# Altium schematic sheet MB979.SchDoc: LCD glass module
size A4; DocumentNumber: 2; Revision: A.1[PCB.SCH]; SheetNumber: 2; SheetTotal: 2
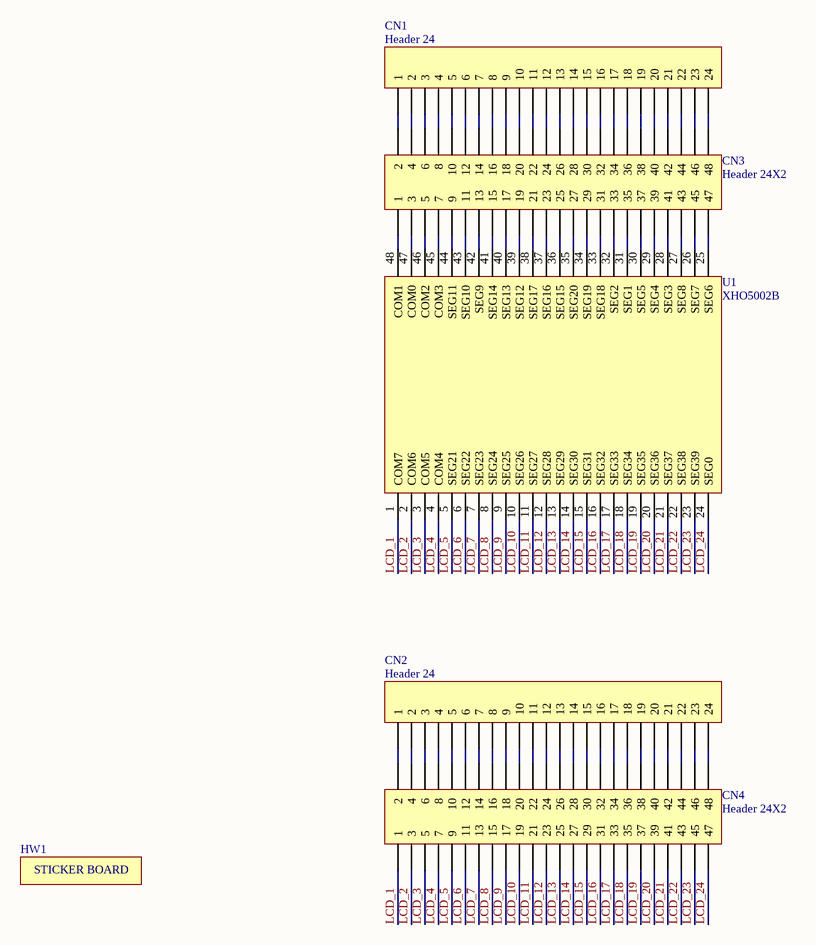
[diagram p0: MB979.SchDoc]

## Parts
CN1  Header 24  [HDR1X24]
CN2  Header 24  [HDR1X24]
CN3  Header 24X2  [HDR2X24]
CN4  Header 24X2  [HDR2X24]
HW1  STICKER_BOARD  (value not drawn)  (no BOM)
U1  XHO5002B

## Nets
LCD_1: CN4.1 U1.1(COM7)
LCD_2: CN4.3 U1.2(COM6)
LCD_3: CN4.5 U1.3(COM5)
LCD_4: CN4.7 U1.4(COM4)
LCD_5: CN4.9 U1.5(SEG21)
LCD_6: CN4.11 U1.6(SEG22)
LCD_7: CN4.13 U1.7(SEG23)
LCD_8: CN4.15 U1.8(SEG24)
LCD_9: CN4.17 U1.9(SEG25)
LCD_10: CN4.19 U1.10(SEG26)
LCD_11: CN4.21 U1.11(SEG27)
LCD_12: CN4.23 U1.12(SEG28)
LCD_13: CN4.25 U1.13(SEG29)
LCD_14: CN4.27 U1.14(SEG30)
LCD_15: CN4.29 U1.15(SEG31)
LCD_16: CN4.31 U1.16(SEG32)
LCD_17: CN4.33 U1.17(SEG33)
LCD_18: CN4.35 U1.18(SEG34)
LCD_19: CN4.37 U1.19(SEG35)
LCD_20: CN4.39 U1.20(SEG36)
LCD_21: CN4.41 U1.21(SEG37)
LCD_22: CN4.43 U1.22(SEG38)
LCD_23: CN4.45 U1.23(SEG39)
LCD_24: CN4.47 U1.24(SEG0)
NetCN1_1: CN1.1 CN3.2
NetCN1_2: CN1.2 CN3.4
NetCN1_3: CN1.3 CN3.6
NetCN1_4: CN1.4 CN3.8
NetCN1_5: CN1.5 CN3.10
NetCN1_6: CN1.6 CN3.12
NetCN1_7: CN1.7 CN3.14
NetCN1_8: CN1.8 CN3.16
NetCN1_9: CN1.9 CN3.18
NetCN1_10: CN1.10 CN3.20
NetCN1_11: CN1.11 CN3.22
NetCN1_12: CN1.12 CN3.24
NetCN1_13: CN1.13 CN3.26
NetCN1_14: CN1.14 CN3.28
NetCN1_15: CN1.15 CN3.30
NetCN1_16: CN1.16 CN3.32
NetCN1_17: CN1.17 CN3.34
NetCN1_18: CN1.18 CN3.36
NetCN1_19: CN1.19 CN3.38
NetCN1_20: CN1.20 CN3.40
NetCN1_21: CN1.21 CN3.42
NetCN1_22: CN1.22 CN3.44
NetCN1_23: CN1.23 CN3.46
NetCN1_24: CN1.24 CN3.48
NetCN2_1: CN2.1 CN4.2
NetCN2_2: CN2.2 CN4.4
NetCN2_3: CN2.3 CN4.6
NetCN2_4: CN2.4 CN4.8
NetCN2_5: CN2.5 CN4.10
NetCN2_6: CN2.6 CN4.12
NetCN2_7: CN2.7 CN4.14
NetCN2_8: CN2.8 CN4.16
NetCN2_9: CN2.9 CN4.18
NetCN2_10: CN2.10 CN4.20
NetCN2_11: CN2.11 CN4.22
NetCN2_12: CN2.12 CN4.24
NetCN2_13: CN2.13 CN4.26
NetCN2_14: CN2.14 CN4.28
NetCN2_15: CN2.15 CN4.30
NetCN2_16: CN2.16 CN4.32
NetCN2_17: CN2.17 CN4.34
NetCN2_18: CN2.18 CN4.36
NetCN2_19: CN2.19 CN4.38
NetCN2_20: CN2.20 CN4.40
NetCN2_21: CN2.21 CN4.42
NetCN2_22: CN2.22 CN4.44
NetCN2_23: CN2.23 CN4.46
NetCN2_24: CN2.24 CN4.48
NetCN3_1: CN3.1 U1.48(COM1)
NetCN3_3: CN3.3 U1.47(COM0)
NetCN3_5: CN3.5 U1.46(COM2)
NetCN3_7: CN3.7 U1.45(COM3)
NetCN3_9: CN3.9 U1.44(SEG11)
NetCN3_11: CN3.11 U1.43(SEG10)
NetCN3_13: CN3.13 U1.42(SEG9)
NetCN3_15: CN3.15 U1.41(SEG14)
NetCN3_17: CN3.17 U1.40(SEG13)
NetCN3_19: CN3.19 U1.39(SEG12)
NetCN3_21: CN3.21 U1.38(SEG17)
NetCN3_23: CN3.23 U1.37(SEG16)
NetCN3_25: CN3.25 U1.36(SEG15)
NetCN3_27: CN3.27 U1.35(SEG20)
NetCN3_29: CN3.29 U1.34(SEG19)
NetCN3_31: CN3.31 U1.33(SEG18)
NetCN3_33: CN3.33 U1.32(SEG2)
NetCN3_35: CN3.35 U1.31(SEG1)
NetCN3_37: CN3.37 U1.30(SEG5)
NetCN3_39: CN3.39 U1.29(SEG4)
NetCN3_41: CN3.41 U1.28(SEG3)
NetCN3_43: CN3.43 U1.27(SEG8)
NetCN3_45: CN3.45 U1.26(SEG7)
NetCN3_47: CN3.47 U1.25(SEG6)

## Notes on the sheet
- Title:
- Project:
- Size:
- Revision:
- Variant:
- A4
- -
- Date:
- Reference:
- Sheet:
- of
- (in symbol STICKER_BOARD) STICKER BOARD

## Library data of the parts
CN1 CN2 = Header 24: Header, 24-Pin; Revision: 17-Jul-2002: Re-released for DXP Platform.; Publisher: Altium Limited
CN3 CN4 = Header 24X2: Header, 24-Pin, Dual row; Revision: 17-Jul-2002: Re-released for DXP Platform.; Publisher: Altium Limited
U1 = XHO5002